# Altium schematic sheet digital_controller.SchDoc
size A
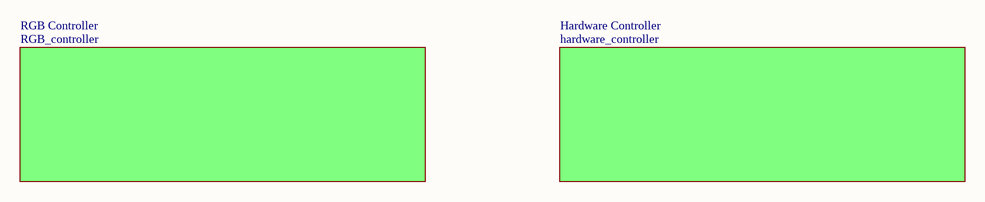
[diagram p0: digital_controller.SchDoc]

## Sub-sheets
Hardware Controller = hardware_controller: no entries
RGB Controller = RGB_controller: no entries